# Altium project ESP32 S3_USB Dongle_V1.0.PrjPcb (part 1 of 3)
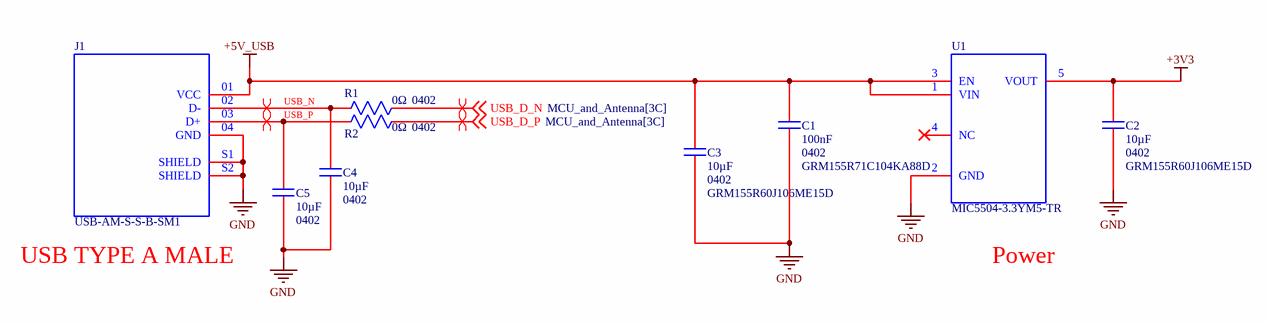
[diagram p0: USB_and_POWER.SchDoc]
5 sheets, 41 parts. Net scope: global (net labels, ports and power ports of the same name join across sheets).
Board file: PCB_V1.0.PcbDoc
Sheets:
  USB_and_POWER.SchDoc
  MCU_and_Antenna.SchDoc
  Display.SchDoc
  EEPROM.SchDoc
  SD_Card.SchDoc

## Sheet USB_and_POWER.SchDoc
size A4; Organization: My Company; Address1: Address Line 1; Address2: Address Line 2; Address3: Address Line 3; Address4: Address Line 4; SheetNumber: 3; SheetTotal: 6

### Parts
C1  GRM155R71C104KA88D  value 100nF  Case/Package: 0402  [CAPC1005X55N]
C2  GRM155R60J106ME15D  value 10µF  Case/Package: 0402  [CAPC1005X55N]
C3  GRM155R60J106ME15D  value 10µF  Case/Package: 0402  [CAPC1005X55N]
C4  value 10µF  Case/Package: 0402  [CAPC1005X55N]  (hidden comment: GRM155R60J106ME15D)
C5  value 10µF  Case/Package: 0402  [CAPC1005X55N]  (hidden comment: GRM155R60J106ME15D)
J1  USB-AM-S-S-B-SM1  [SAMTEC_USB-AM-S-X-X-SM1]
R1  value 0Ω  Case/Package: 0402  [RC0402N_YAG-M]  (hidden comment: RC0402JR-070RL)
R2  value 0Ω  Case/Package: 0402  [RC0402N_YAG-M]  (hidden comment: RC0402JR-070RL)
U1  MIC5504-3.3YM5-TR  [SOT-23-5_MC_MCH]

### Nets
+3V3: C2.2 U1.5(VOUT)
+5V_USB: C1.2 C3.2 J1.01(VCC) U1.1(VIN) U1.3(EN)
GND: C1.1 C2.1 C3.1 C4.1 C5.1 J1.04(GND) J1.S1(SHIELD) J1.S2(SHIELD) U1.2(GND)
USB_D_N: R1.2 ; off-sheet USB_D_N
USB_D_P: R2.2 ; off-sheet USB_D_P
USB_N: C4.2 J1.02(D-) R1.1
USB_P: C5.2 J1.03(D+) R2.1

Not connected (* = marked no-connect by the designer): U1 4(NC)*

### Layout directives
differential pair; differential pair class Diff 90: USB_D_N, USB_D_P, USB_N, USB_P

### Notes on the sheet
- USB TYPE A MALE
- Power
- Author:
- Title:
- Size:
- A4
- Project:
- Approved:
- Revision:
- Modified Date:
- CONFIDENTIAL
- Date:
- SW Version:

### Library data of the parts
C1 = GRM155R71C104KA88D: 16V 100nF X7R ±10% 0402 Multilayer Ceramic Capacitors MLCC - SMD/SMT ROHS; Manufacturer: Murata; Manufacturer Lifecycle Status: NRND; Insulation Resistance: 10GΩ; Supplier: DigiKey; Supplier Part Number: 490-3261-1-ND; Manufacturer Part Number: GRM155R71C104KA88D; RoHS: Compliant; Category: Ceramic Capacitors; Stock: 10363582; Pricing: 1=0,1, 10=0,024, 50=0,0156, 100=0,0132, 500=0,00926, 1000=0,00805, 2500=0,00678, 5000=0,00602 (USD); Case Code (Imperial): 0402; Case Code (Metric): 1005; Country of Origin: Japan, Mainland China, Philippines, Singapore, Thailand; Depth: 500µm; Dielectric: X7R; Dielectric Material: Ceramic; Export Control Classification Number (ECCN) Code: EAR99; Height: 500µm; Harmonized Tariff Schedule (HTS) Code: 8532.24.00.20; Introduction Date: 2004-11-19; Lead Free: Lead Free; Length: 1mm; Lifecycle Status: NRND; Material: Ceramic; Max Operating Temperature: 125°C; Min Operating Temperature: -55°C; Mounting Technology: Surface Mount; Pins: 2; Number of Terminals: 2; Packaging: Cut Tape; Radiation Hardening: No; REACH SVHC: Yes; Schedule B: 8532240020, 8532240020|8532240020|8532240020|8532240020|8532240020|8532240020|8532240020|8532240020|8532240020|8532240020|8532240020|8532240020|8532240020, 8532240020|8532240020|8532240020|8532240020|8532240020|8532240020|8532240020|8532240020|8532240020|8532240020|8532240020|8532240020|8532240020|8532240020, 8532240020|8532240020|8532240020|8532240020|8532240020|8532240020|8532240020|8532240020|8532240020|8532240020|8532240020|8532240020|8532240020|8532240020|8532240020; Termination: SMD/SMT; Thickness: 500µm; Tolerance: 10%; Voltage: 16V; Voltage Rating: 16V; Voltage Rating (DC): 16V; Width: 500µm; ComponentLink1URL: https://datasheet.octopart.com:443/GRM155R71C104KA88D-Murata-datasheet-6387203.pdf?src-supplier=Upverter; ComponentLink1Description: https://datasheet.octopart.com:443/GRM155R71C104KA88D-Murata-datasheet-6387203.pdf?src-supplier=Upverter; ComponentLink2URL: https://datasheet.octopart.com:443/GRM155R71C104KA88D-Murata-datasheet-501912.pdf?src-supplier=Farnell; ComponentLink2Description: https://datasheet.octopart.com:443/GRM155R71C104KA88D-Murata-datasheet-501912.pdf?src-supplier=Farnell; ComponentLink3URL: https://datasheet.octopart.com:443/GRM155R71C104KA88D-Murata-datasheet-62320226.pdf?src-supplier=Farnell; ComponentLink3Description: https://datasheet.octopart.com:443/GRM155R71C104KA88D-Murata-datasheet-62320226.pdf?src-supplier=Farnell; ComponentLink4URL: https://datasheet.octopart.com:443/GRM155R71C104KA88D-Murata-datasheet-514334.pdf?src-supplier=Farnell; ComponentLink4Description: https://datasheet.octopart.com:443/GRM155R71C104KA88D-Murata-datasheet-514334.pdf?src-supplier=Farnell; ComponentLink5URL: https://datasheet.octopart.com:443/GRM155R71C104KA88D-Murata-datasheet-165579666.pdf?src-supplier=TME; ComponentLink5Description: https://datasheet.octopart.com:443/GRM155R71C104KA88D-Murata-datasheet-165579666.pdf?src-supplier=TME; ComponentLink6URL: https://datasheet.octopart.com:443/GRM155R71C104KA88D-Murata-datasheet-81455578.pdf?src-supplier=TME; ComponentLink6Description: https://datasheet.octopart.com:443/GRM155R71C104KA88D-Murata-datasheet-81455578.pdf?src-supplier=TME; ComponentLink7URL: https://datasheet.octopart.com:443/GRM155R71C104KA88D-Murata-datasheet-59876780.pdf?src-supplier=TME; ComponentLink7Description: https://datasheet.octopart.com:443/GRM155R71C104KA88D-Murata-datasheet-59876780.pdf?src-supplier=TME; ComponentLink8URL: https://datasheet.octopart.com:443/GRM155R71C104KA88D-Murata-datasheet-141266224.pdf?src-supplier=Ciiva; ComponentLink8Description: https://datasheet.octopart.com:443/GRM155R71C104KA88D-Murata-datasheet-141266224.pdf?src-supplier=Ciiva; ComponentLink9URL: https://datasheet.octopart.com:443/GRM155R71C104KA88D-Murata-datasheet-140690972.pdf?src-supplier=Ciiva; ComponentLink9Description: https://datasheet.octopart.com:443/GRM155R71C104KA88D-Murata-datasheet-140690972.pdf?src-supplier=Ciiva; ComponentLink10URL: https://datasheet.octopart.com:443/GRM155R71C104KA88D-Murata-datasheet-138740890.pdf?src-supplier=Ciiva; ComponentLink10Description: https://datasheet.octopart.com:443/GRM155R71C104KA88D-Murata-datasheet-138740890.pdf?src-supplier=Ciiva; ComponentLink11URL: https://datasheet.octopart.com:443/GRM155R71C104KA88D-Murata-datasheet-120101189.pdf?src-supplier=Megastar; ComponentLink11Description: https://datasheet.octopart.com:443/GRM155R71C104KA88D-Murata-datasheet-120101189.pdf?src-supplier=Megastar; ComponentLink12URL: https://datasheet.octopart.com:443/GRM155R71C104KA88D-Murata-datasheet-96971104.pdf?src-supplier=Future+Electronics; ComponentLink12Description: https://datasheet.octopart.com:443/GRM155R71C104KA88D-Murata-datasheet-96971104.pdf?src-supplier=Future+Electronics; ComponentLink13URL: https://datasheet.octopart.com:443/GRM155R71C104KA88D-Murata-datasheet-22122223.pdf?src-supplier=Future+Electronics; ComponentLink13Description: https://datasheet.octopart.com:443/GRM155R71C104KA88D-Murata-datasheet-22122223.pdf?src-supplier=Future+Electronics; ComponentLink14URL: https://datasheet.octopart.com:443/GRM155R71C104KA88D-Murata-datasheet-14400564.pdf?src-supplier=Future+Electronics; ComponentLink14Description: https://datasheet.octopart.com:443/GRM155R71C104KA88D-Murata-datasheet-14400564.pdf?src-supplier=Future+Electronics; ComponentLink15URL: https://datasheet.octopart.com:443/GRM155R71C104KA88D-Murata-datasheet-44106293.pdf?src-supplier=Future+Electronics; ComponentLink15Description: https://datasheet.octopart.com:443/GRM155R71C104KA88D-Murata-datasheet-44106293.pdf?src-supplier=Future+Electronics; ComponentLink16URL: https://datasheet.octopart.com/GRM155R71C104KA88D-Murata-datasheet-12515295.pdf; ComponentLink16Description: https://datasheet.octopart.com/GRM155R71C104KA88D-Murata-datasheet-12515295.pdf; ComponentLink17URL: https://datasheet.octopart.com/GRM155R71C104KA88D-Murata-datasheet-12510076.pdf; ComponentLink17Description: https://datasheet.octopart.com/GRM155R71C104KA88D-Murata-datasheet-12510076.pdf; ComponentLink18URL: https://datasheet.octopart.com/GRM155R71C104KA88D-Murata-datasheet-11978611.pdf; ComponentLink18Description: https://datasheet.octopart.com/GRM155R71C104KA88D-Murata-datasheet-11978611.pdf; ComponentLink19URL: https://datasheet.octopart.com/GRM155R71C104KA88D-Murata-datasheet-10025737.pdf; ComponentLink19Description: https://datasheet.octopart.com/GRM155R71C104KA88D-Murata-datasheet-10025737.pdf; ComponentLink20URL: https://datasheet.octopart.com/GRM155R71C104KA88D-Murata-datasheet-8819587.pdf; ComponentLink20Description: https://datasheet.octopart.com/GRM155R71C104KA88D-Murata-datasheet-8819587.pdf; ComponentLink21URL: https://datasheet.octopart.com/GRM155R71C104KA88D-Murata-datasheet-12555248.pdf; ComponentLink21Description: https://datasheet.octopart.com/GRM155R71C104KA88D-Murata-datasheet-12555248.pdf; ComponentLink22URL: https://datasheet.octopart.com:443/GRM155R71C104KA88D-Murata-datasheet-11864723.pdf?src-supplier=Arrow+Electronics; ComponentLink22Description: https://datasheet.octopart.com:443/GRM155R71C104KA88D-Murata-datasheet-11864723.pdf?src-supplier=Arrow+Electronics; ComponentLink23URL: https://datasheet.octopart.com:443/GRM155R71C104KA88D-Murata-datasheet-148211.pdf?src-supplier=Garrett; ComponentLink23Description: https://datasheet.octopart.com:443/GRM155R71C104KA88D-Murata-datasheet-148211.pdf?src-supplier=Garrett; ComponentLink24URL: https://datasheet.octopart.com:443/GRM155R71C104KA88D-Murata-datasheet-118811.pdf?src-supplier=DigiKey; ComponentLink24Description: https://datasheet.octopart.com:443/GRM155R71C104KA88D-Murata-datasheet-118811.pdf?src-supplier=DigiKey; ComponentLink25URL: https://datasheet.octopart.com:443/GRM155R71C104KA88D-Murata-datasheet-38265814.pdf?src-supplier=Newark; ComponentLink25Description: https://datasheet.octopart.com:443/GRM155R71C104KA88D-Murata-datasheet-38265814.pdf?src-supplier=Newark; ComponentLink26URL: http://sigma.octopart.com:80/reach_statement/Murata-company-16.pdf?src-supplier=Compliance+Statements; ComponentLink26Description: http://sigma.octopart.com:80/reach_statement/Murata-company-16.pdf?src-supplier=Compliance+Statements; LCSC Part: C71629
C2-C5 = GRM155R60J106ME15D: 6.3V 10uF X5R ±20% 0402 Multilayer Ceramic Capacitors MLCC - SMD/SMT ROHS; Manufacturer: Murata; Manufacturer Lifecycle Status: IN PRODUCTION; Supplier: DigiKey; Supplier Part Number: 490-13238-6-ND; Manufacturer Part Number: GRM155R60J106ME15D; RoHS: Compliant; Category: Ceramic Capacitors; Stock: 101484; Pricing: 1=0,16, 10=0,088, 50=0,0618, 100=0,0538, 500=0,04036, 1000=0,03624, 2500=0,0319, 5000=0,02929 (USD); Case Code (Imperial): 0402; Case Code (Metric): 1005; Dielectric: X5R; Dielectric Material: Ceramic; Height: 500µm; Length: 1mm; Lifecycle Status: Production; Material: Ceramic; Max Operating Temperature: 85°C; Min Operating Temperature: -55°C; Mounting Technology: Surface Mount; Number of Terminals: 2; REACH SVHC: Yes; Schedule B: 8532240020, 8532240020|8532240020, 8532240020|8532240020|8532240020, 8532240020|8532240020|8532240020|8532240020; Thickness: 500µm; Tolerance: 20%; Voltage Rating: 6.3V; Voltage Rating (DC): 6.3V; Width: 500µm; ComponentLink1URL: https://datasheet.octopart.com:443/GRM155R60J106ME15D-Murata-datasheet-149522992.pdf?src-supplier=Newark; ComponentLink1Description: https://datasheet.octopart.com:443/GRM155R60J106ME15D-Murata-datasheet-149522992.pdf?src-supplier=Newark; ComponentLink2URL: https://datasheet.octopart.com:443/GRM155R60J106ME15D-Murata-datasheet-165579666.pdf?src-supplier=TME; ComponentLink2Description: https://datasheet.octopart.com:443/GRM155R60J106ME15D-Murata-datasheet-165579666.pdf?src-supplier=TME; ComponentLink3URL: https://datasheet.octopart.com:443/GRM155R60J106ME15D-Murata-datasheet-141266224.pdf?src-supplier=Ciiva; ComponentLink3Description: https://datasheet.octopart.com:443/GRM155R60J106ME15D-Murata-datasheet-141266224.pdf?src-supplier=Ciiva; ComponentLink4URL: https://datasheet.octopart.com:443/GRM155R60J106ME15D-Murata-datasheet-140689297.pdf?src-supplier=Ciiva; ComponentLink4Description: https://datasheet.octopart.com:443/GRM155R60J106ME15D-Murata-datasheet-140689297.pdf?src-supplier=Ciiva; ComponentLink5URL: https://datasheet.octopart.com:443/GRM155R60J106ME15D-Murata-datasheet-138740639.pdf?src-supplier=Ciiva; ComponentLink5Description: https://datasheet.octopart.com:443/GRM155R60J106ME15D-Murata-datasheet-138740639.pdf?src-supplier=Ciiva; ComponentLink6URL: https://datasheet.octopart.com:443/GRM155R60J106ME15D-Murata-datasheet-102370999.pdf?src-supplier=HQonline; ComponentLink6Description: https://datasheet.octopart.com:443/GRM155R60J106ME15D-Murata-datasheet-102370999.pdf?src-supplier=HQonline; ComponentLink7URL: https://datasheet.octopart.com/GRM155R60J106ME15D-Murata-datasheet-12515295.pdf; ComponentLink7Description: https://datasheet.octopart.com/GRM155R60J106ME15D-Murata-datasheet-12515295.pdf; ComponentLink8URL: https://datasheet.octopart.com/GRM155R60J106ME15D-Murata-datasheet-12510076.pdf; ComponentLink8Description: https://datasheet.octopart.com/GRM155R60J106ME15D-Murata-datasheet-12510076.pdf; ComponentLink9URL: https://datasheet.octopart.com/GRM155R60J106ME15D-Murata-datasheet-11978611.pdf; ComponentLink9Description: https://datasheet.octopart.com/GRM155R60J106ME15D-Murata-datasheet-11978611.pdf; ComponentLink10URL: https://datasheet.octopart.com/GRM155R60J106ME15D-Murata-datasheet-10025737.pdf; ComponentLink10Description: https://datasheet.octopart.com/GRM155R60J106ME15D-Murata-datasheet-10025737.pdf; ComponentLink11URL: https://datasheet.octopart.com/GRM155R60J106ME15D-Murata-datasheet-8819587.pdf; ComponentLink11Description: https://datasheet.octopart.com/GRM155R60J106ME15D-Murata-datasheet-8819587.pdf; ComponentLink12URL: http://sigma.octopart.com:80/reach_statement/Murata-company-16.pdf?src-supplier=Compliance+Statements; ComponentLink12Description: http://sigma.octopart.com:80/reach_statement/Murata-company-16.pdf?src-supplier=Compliance+Statements; LCSC Part: C412251
J1 = USB-AM-S-S-B-SM1: USB Connector, USB Type A, USB 2.0, Plug, 4 Positions, Surface Mount, Right Angle; Manufacturer: Samtec; Manufacturer Lifecycle Status: PRODUCTION; Gender: Male; Max Voltage Rating (AC): 30V; Number of Contacts: 4; Number of Ports: 1; Supplier: DigiKey; Supplier Part Number: SAM13046-ND; Manufacturer Part Number: USB-AM-S-S-B-SM1; RoHS: Compliant; Category: Coaxial / RF Cable Assemblies; Stock: 10; Pricing: 1=3,56, 50=2,901, 100=2,462, 500=2,345 (USD); Contact Material: Bronze; Contact Plating: Gold; Depth: 20.7mm; Housing Material: Thermoplastic; Length: 12.5mm; Lifecycle Status: Production; Max Operating Temperature: 85°C; Min Operating Temperature: -50°C; Mounting Technology: Surface Mount; Number of Terminals: 4; Orientation: Right Angle; Packaging: Bulk; Radiation Hardening: No; Termination: Solder; ComponentLink1URL: https://datasheet.octopart.com:443/USB-AM-S-S-B-SM1-Samtec-datasheet-97369336.pdf?src-supplier=Sager+Electronics; ComponentLink1Description: https://datasheet.octopart.com:443/USB-AM-S-S-B-SM1-Samtec-datasheet-97369336.pdf?src-supplier=Sager+Electronics; ComponentLink2URL: https://datasheet.octopart.com:443/USB-AM-S-S-B-SM1-Samtec-datasheet-154665717.pdf?src-supplier=Sager+Electronics; ComponentLink2Description: https://datasheet.octopart.com:443/USB-AM-S-S-B-SM1-Samtec-datasheet-154665717.pdf?src-supplier=Sager+Electronics; ComponentLink3URL: https://sigma.octopart.com:443/97369342/technical_drawing/Samtec-USB-AM-S-S-B-SM1.pdf?src-supplier=Samtec; ComponentLink3Description: https://sigma.octopart.com:443/97369342/technical_drawing/Samtec-USB-AM-S-S-B-SM1.pdf?src-supplier=Samtec; ComponentLink4URL: https://datasheet.octopart.com:443/USB-AM-S-S-B-SM1-Samtec-datasheet-150883678.pdf?src-supplier=Electro+Sonic; ComponentLink4Description: https://datasheet.octopart.com:443/USB-AM-S-S-B-SM1-Samtec-datasheet-150883678.pdf?src-supplier=Electro+Sonic; ComponentLink5URL: https://datasheet.octopart.com:443/USB-AM-S-S-B-SM1-Samtec-datasheet-130009934.pdf?src-supplier=Electro+Sonic; ComponentLink5Description: https://datasheet.octopart.com:443/USB-AM-S-S-B-SM1-Samtec-datasheet-130009934.pdf?src-supplier=Electro+Sonic; ComponentLink6URL: https://datasheet.octopart.com:443/USB-AM-S-S-B-SM1-Samtec-datasheet-21561734.pdf?src-supplier=Farnell; ComponentLink6Description: https://datasheet.octopart.com:443/USB-AM-S-S-B-SM1-Samtec-datasheet-21561734.pdf?src-supplier=Farnell; ComponentLink7URL: https://datasheet.octopart.com:443/USB-AM-S-S-B-SM1-Samtec-datasheet-180264035.pdf?src-supplier=JRH+Electronics; ComponentLink7Description: https://datasheet.octopart.com:443/USB-AM-S-S-B-SM1-Samtec-datasheet-180264035.pdf?src-supplier=JRH+Electronics; ComponentLink8URL: https://datasheet.octopart.com:443/USB-AM-S-S-B-SM1-Samtec-datasheet-120095689.pdf?src-supplier=Toby+Electronics; ComponentLink8Description: https://datasheet.octopart.com:443/USB-AM-S-S-B-SM1-Samtec-datasheet-120095689.pdf?src-supplier=Toby+Electronics; ComponentLink9URL: https://datasheet.octopart.com:443/USB-AM-S-S-B-SM1-Samtec-datasheet-116536465.pdf?src-supplier=Toby+Electronics; ComponentLink9Description: https://datasheet.octopart.com:443/USB-AM-S-S-B-SM1-Samtec-datasheet-116536465.pdf?src-supplier=Toby+Electronics; ComponentLink10URL: https://datasheet.octopart.com:443/USB-AM-S-S-B-SM1-Samtec-datasheet-13694303.pdf?src-supplier=_legacy+Avnet; ComponentLink10Description: https://datasheet.octopart.com:443/USB-AM-S-S-B-SM1-Samtec-datasheet-13694303.pdf?src-supplier=_legacy+Avnet; LCSC Part: C7374540
R1 R2 = RC0402JR-070RL: GENERAL PURPOSE CHIP RESISTOR Metal Glaze/thick Film, 0.0625W, 0ohm, Surface Mount, 0402; Manufacturer: Yageo Group; Max Power Dissipation: 63mW; Power Rating: 62.5mW; Temperature Coefficient: 200ppm/°C; Tolerance: 5%; Voltage Rating: 50V; Supplier: DigiKey; Supplier Part Number: 311-0.0JRDKR-ND; Manufacturer Part Number: RC0402JR-070RL; RoHS: Compliant; Category: Chip SMD Resistors; Stock: 12719023; Pricing: 1=0,1, 10=0,010, 25=0,0064, 50=0,0056, 100=0,0048, 250=0,00404, 500=0,00356, 1000=0,00313, 5000=0,00237 (USD); Case Code (Imperial): 0402; China RoHS: Non-Compliant; Composition: Thick Film; Contact Plating: Tin; Depth: 500µm; Features: Moisture Resistant; Height: 350µm; Lead Free: Lead Free; Length: 1mm; Lifecycle Status: Production; Max Operating Temperature: 155°C; Military Standard: Not; Min Operating Temperature: -55°C; Mounting Technology: Surface Mount; Pins: 2; Number of Terminals: 2; Number of Terminations: 2; Packaging: Tape & Reel; Radiation Hardening: No; REACH SVHC: Yes; Schedule B: 8533290000, 8533290000|8533290000, 8533290000|8533290000|8533290000, 8533290000|8533290000|8533290000|8533290000; Termination: SMD/SMT; Voltage Rating (DC): 50V; Width: 500µm; ComponentLink1URL: https://datasheet.octopart.com:443/RC0402JR-070RL-Yageo-datasheet-182189538.pdf?src-supplier=IHS; ComponentLink1Description: https://datasheet.octopart.com:443/RC0402JR-070RL-Yageo-datasheet-182189538.pdf?src-supplier=IHS; ComponentLink2URL: https://datasheet.octopart.com:443/RC0402JR-070RL-Yageo-datasheet-10408619.pdf?src-supplier=Newark; ComponentLink2Description: https://datasheet.octopart.com:443/RC0402JR-070RL-Yageo-datasheet-10408619.pdf?src-supplier=Newark; ComponentLink3URL: https://datasheet.octopart.com:443/RC0402JR-070RL-Yageo-Group-datasheet-181964826.pdf?src-supplier=Newark; ComponentLink3Description: https://datasheet.octopart.com:443/RC0402JR-070RL-Yageo-Group-datasheet-181964826.pdf?src-supplier=Newark; ComponentLink4URL: https://datasheet.octopart.com:443/RC0402JR-070RL-Yageo-Group-datasheet-190305687.pdf?src-supplier=Future+Electronics; ComponentLink4Description: https://datasheet.octopart.com:443/RC0402JR-070RL-Yageo-Group-datasheet-190305687.pdf?src-supplier=Future+Electronics; ComponentLink5URL: https://datasheet.octopart.com:443/RC0402JR-070RL-Yageo-datasheet-164759695.pdf?src-supplier=Future+Electronics; ComponentLink5Description: https://datasheet.octopart.com:443/RC0402JR-070RL-Yageo-datasheet-164759695.pdf?src-supplier=Future+Electronics; ComponentLink6URL: https://datasheet.octopart.com:443/RC0402JR-070RL-Yageo-datasheet-137700087.pdf?src-supplier=Future+Electronics; ComponentLink6Description: https://datasheet.octopart.com:443/RC0402JR-070RL-Yageo-datasheet-137700087.pdf?src-supplier=Future+Electronics; ComponentLink7URL: https://datasheet.octopart.com:443/RC0402JR-070RL-Yageo-datasheet-12531192.pdf?src-supplier=Seeed+Studio; ComponentLink7Description: https://datasheet.octopart.com:443/RC0402JR-070RL-Yageo-datasheet-12531192.pdf?src-supplier=Seeed+Studio; ComponentLink8URL: https://datasheet.octopart.com:443/RC0402JR-070RL-Yageo-datasheet-8324527.pdf?src-supplier=TME; ComponentLink8Description: https://datasheet.octopart.com:443/RC0402JR-070RL-Yageo-datasheet-8324527.pdf?src-supplier=TME; ComponentLink9URL: https://datasheet.octopart.com:443/RC0402JR-070RL-Yageo-datasheet-62067350.pdf?src-supplier=Farnell; ComponentLink9Description: https://datasheet.octopart.com:443/RC0402JR-070RL-Yageo-datasheet-62067350.pdf?src-supplier=Farnell; ComponentLink10URL: https://datasheet.octopart.com:443/RC0402JR-070RL-Yageo-datasheet-8329306.pdf?src-supplier=element14; ComponentLink10Description: https://datasheet.octopart.com:443/RC0402JR-070RL-Yageo-datasheet-8329306.pdf?src-supplier=element14; ComponentLink11URL: https://datasheet.octopart.com:443/RC0402JR-070RL-Yageo-datasheet-505231.pdf?src-supplier=element14; ComponentLink11Description: https://datasheet.octopart.com:443/RC0402JR-070RL-Yageo-datasheet-505231.pdf?src-supplier=element14; ComponentLink12URL: https://datasheet.octopart.com:443/RC0402JR-070RL-Yageo-datasheet-175423674.pdf?src-supplier=SOS+electronic; ComponentLink12Description: https://datasheet.octopart.com:443/RC0402JR-070RL-Yageo-datasheet-175423674.pdf?src-supplier=SOS+electronic; ComponentLink13URL: https://datasheet.octopart.com/RC0402JR-070RL-Yageo-datasheet-73766026.pdf; ComponentLink13Description: https://datasheet.octopart.com/RC0402JR-070RL-Yageo-datasheet-73766026.pdf; ComponentLink14URL: http://sigma.octopart.com:80/conflict_mineral_statement/Yageo-company-3.pdf?src-supplier=Compliance+Statements; ComponentLink14Description: http://sigma.octopart.com:80/conflict_mineral_statement/Yageo-company-3.pdf?src-supplier=Compliance+Statements; ComponentLink15URL: http://sigma.octopart.com:80/rohs_statement/Yageo-company-2.pdf?src-supplier=Compliance+Statements; ComponentLink15Description: http://sigma.octopart.com:80/rohs_statement/Yageo-company-2.pdf?src-supplier=Compliance+Statements; LCSC Part: C60485
U1 = MIC5504-3.3YM5-TR: MIC5504 Series 3.3 V 300 mA Surface Mount Fixed Single Output LDO - SOT-23-5; Manufacturer: Microchip; Manufacturer Lifecycle Status: REL; Accuracy: 2%; Dropout Voltage: 160mV; Max Supply Voltage: 5.5V; Max Junction Temperature (Tj): 125°C; Max Output current: 300mA; Min Current Limit: 400mA; Min Input Voltage: 2.5V; Nominal Output Voltage: 3.3V; Number of Channels: 1; Operating Supply Current: 42µA; Output Voltage: 3.3mV; Power Supply Rejection Ratio (PSRR): 60dB; Quiescent Current: 38µA; Supplier: DigiKey; Supplier Part Number: 576-4764-6-ND; Manufacturer Part Number: MIC5504-3.3YM5-TR; RoHS: Compliant; Category: LDO Voltage Regulators; Stock: 122252; Pricing: 1=0,16, 25=0,1224 (USD); Projected EOL Date: 2039-05-20; Case/Package: SOT-23; Country of Assembly: Thailand; Country of Fabrication: South Korea; Country of Origin: Thailand; Export Control Classification Number (ECCN) Code: EAR99; Height: 1.45mm; HS Code: 8542.39.0090; Harmonized Tariff Schedule (HTS) Code: 8542.39.0060; Lead Free: Lead Free; Length: 2.9mm; Lifecycle Status: Production; Max Operating Temperature: 125°C; Min Operating Temperature: -40°C; Min Supply Voltage: 2.5V; Mounting Technology: Surface Mount; Number of Outputs: 1; Pins: 5; Number of Regulators: 1; Output Current: 300mA; Output Type: Fixed; Packaging: Cut Tape; REACH SVHC: No; Schedule B: 8542390000, 8542390000|8542390000|8542390000|8542390000|8542390000; Width: 1.6mm; ComponentLink1URL: https://datasheet.octopart.com:443/MIC5504-3.3YM5-TR-Microchip-datasheet-178203070.pdf?src-supplier=Microchip; ComponentLink1Description: https://datasheet.octopart.com:443/MIC5504-3.3YM5-TR-Microchip-datasheet-178203070.pdf?src-supplier=Microchip; ComponentLink2URL: https://datasheet.octopart.com:443/MIC5504-3.3YM5-TR-Microchip-datasheet-137404938.pdf?src-supplier=Microchip; ComponentLink2Description: https://datasheet.octopart.com:443/MIC5504-3.3YM5-TR-Microchip-datasheet-137404938.pdf?src-supplier=Microchip; ComponentLink3URL: https://datasheet.octopart.com:443/MIC5504-3.3YM5-TR-Microchip-datasheet-138897052.pdf?src-supplier=SOS+electronic; ComponentLink3Description: https://datasheet.octopart.com:443/MIC5504-3.3YM5-TR-Microchip-datasheet-138897052.pdf?src-supplier=SOS+electronic; ComponentLink4URL: https://datasheet.octopart.com:443/MIC5504-3.3YM5-TR-Microchip-datasheet-61114938.pdf?src-supplier=element14+APAC; ComponentLink4Description: https://datasheet.octopart.com:443/MIC5504-3.3YM5-TR-Microchip-datasheet-61114938.pdf?src-supplier=element14+APAC; ComponentLink5URL: https://datasheet.octopart.com:443/MIC5504-3.3YM5-TR-Microchip-datasheet-33028821.pdf?src-supplier=Newark; ComponentLink5Description: https://datasheet.octopart.com:443/MIC5504-3.3YM5-TR-Microchip-datasheet-33028821.pdf?src-supplier=Newark; ComponentLink6URL: https://datasheet.octopart.com:443/MIC5504-3.3YM5-TR-Microchip-datasheet-137453438.pdf?src-supplier=Master+Electronics; ComponentLink6Description: https://datasheet.octopart.com:443/MIC5504-3.3YM5-TR-Microchip-datasheet-137453438.pdf?src-supplier=Master+Electronics; ComponentLink7URL: https://datasheet.octopart.com:443/MIC5504-3.3YM5-TR-Microchip-datasheet-142675560.pdf?src-supplier=TME; ComponentLink7Description: https://datasheet.octopart.com:443/MIC5504-3.3YM5-TR-Microchip-datasheet-142675560.pdf?src-supplier=TME; ComponentLink8URL: http://sigma.octopart.com:80/188454461/materials_sheet/Microchip-MIC5504-3.3YM5-TR.pdf?src-supplier=Compliance+Statements; ComponentLink8Description: http://sigma.octopart.com:80/188454461/materials_sheet/Microchip-MIC5504-3.3YM5-TR.pdf?src-supplier=Compliance+Statements; ComponentLink9URL: http://sigma.octopart.com:80/rohs_statement/Microchip-company-71.pdf?src-supplier=Compliance+Statements; ComponentLink9Description: http://sigma.octopart.com:80/rohs_statement/Microchip-company-71.pdf?src-supplier=Compliance+Statements; ComponentLink10URL: http://sigma.octopart.com:80/reach_statement/Microchip-company-70.pdf?src-supplier=Compliance+Statements; ComponentLink10Description: http://sigma.octopart.com:80/reach_statement/Microchip-company-70.pdf?src-supplier=Compliance+Statements; ComponentLink11URL: http://sigma.octopart.com:80/conflict_mineral_statement/Microchip-company-69.pdf?src-supplier=Compliance+Statements; ComponentLink11Description: http://sigma.octopart.com:80/conflict_mineral_statement/Microchip-company-69.pdf?src-supplier=Compliance+Statements; ComponentLink12URL: http://sigma.octopart.com:80/conflict_mineral_statement/Microchip-company-68.pdf?src-supplier=Compliance+Statements; ComponentLink12Description: http://sigma.octopart.com:80/conflict_mineral_statement/Microchip-company-68.pdf?src-supplier=Compliance+Statements; LCSC Part: C88419

## Sheet MCU_and_Antenna.SchDoc
size A4; Organization: My Company; Address1: Address Line 1; Address2: Address Line 2; Address3: Address Line 3; Address4: Address Line 4; SheetNumber: 4; SheetTotal: 6
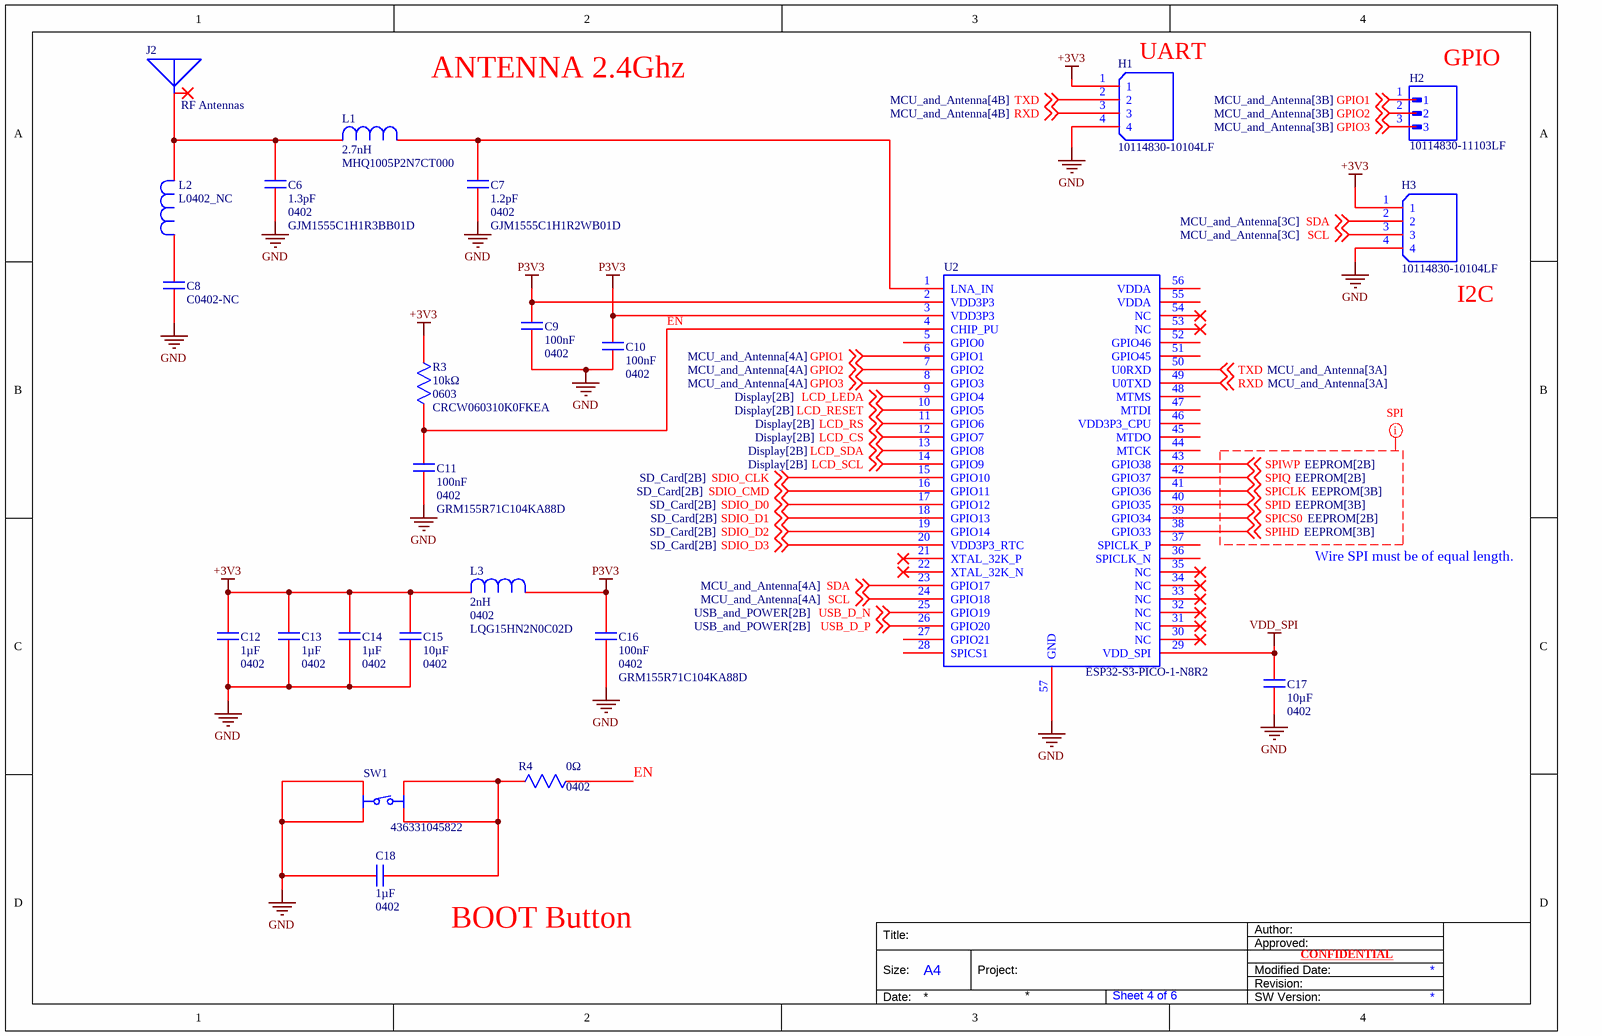
[diagram p1: MCU_and_Antenna.SchDoc]

### Parts
C6  GJM1555C1H1R3BB01D  value 1.3pF  Case Code (Imperial): 0402  [CAPC1005X55N]
C7  GJM1555C1H1R2WB01D  value 1.2pF  Case/Package: 0402  [CAPC1005X55N]
C8  C0402-NC  [CAPC1005X55N - NC]
C9  value 100nF  Case/Package: 0402  [CAPC1005X55N]  (hidden comment: GRM155R71C104KA88D)
C10  value 100nF  Case/Package: 0402  [CAPC1005X55N]  (hidden comment: GRM155R71C104KA88D)
C11  GRM155R71C104KA88D  value 100nF  Case/Package: 0402  [CAPC1005X55N]
C12  value 1µF  Case/Package: 0402  [CAPC1005X55N]  (hidden comment: CL05A105KP5NNNC)
C13  value 1µF  Case/Package: 0402  [CAPC1005X55N]  (hidden comment: CL05A105KP5NNNC)
C14  value 1µF  Case/Package: 0402  [CAPC1005X55N]  (hidden comment: CL05A105KP5NNNC)
C15  value 10µF  Case/Package: 0402  [CAPC1005X55N]  (hidden comment: GRM155R60J106ME15D)
C16  GRM155R71C104KA88D  value 100nF  Case/Package: 0402  [CAPC1005X55N]
C17  value 10µF  Case/Package: 0402  [CAPC1005X55N]  (hidden comment: GRM155R60J106ME15D)
C18  value 1µF  Case/Package: 0402  [CAPC1005X55N]  (hidden comment: CL05A105KP5NNNC)
H1  10114830-10104LF  [AMPHENOL_10114830-10104LF]
H2  10114830-11103LF  [AMPHENOL_10114830-11103LF]
H3  10114830-10104LF  [AMPHENOL_10114830-10104LF]
J2  RF Antennas  [ANT3216LL00R2400A]
L1  MHQ1005P2N7CT000  value 2.7nH  [IND_1005_TDK]
L2  L0402_NC  [IND_1005_TDK_NC]
L3  LQG15HN2N0C02D  value 2nH  Case/Package: 0402  [INDC1005X55N]
R3  CRCW060310K0FKEA  value 10kΩ  Case Code (Imperial): 0603  [RES_CRCW_0603]
R4  value 0Ω  Case/Package: 0402  [RC0402N_YAG-M]  (hidden comment: RC0402JR-070RL)
SW1  436331045822  [436331045822]
U2  ESP32-S3-PICO-1-N8R2  [QFN56_7X7_EXP-L]

### Nets
+3V3: C12.2 C13.2 C14.2 C15.2 H1.1 H3.1 L3.2 R3.1
GND: C6.1 C7.1 C8.1 C9.2 C10.2 C11.2 C12.1 C13.1 C14.1 C15.1 C16.2 C17.1 C18.2 H1.4 H3.4 SW1.1 SW1.3 U2.57(GND)
P3V3: C9.1 C10.1 C16.1 L3.1 U2.2(VDD3P3) U2.3(VDD3P3)
VDD_SPI: C17.2 U2.29(VDD_SPI)
EN: C11.1 R3.2 R4.2 U2.4(CHIP_PU)
GPIO1: H2.1 U2.6(GPIO1) ; off-sheet GPIO1
GPIO2: H2.2 U2.7(GPIO2) ; off-sheet GPIO2
GPIO3: H2.3 U2.8(GPIO3) ; off-sheet GPIO3
LCD_CS: U2.12(GPIO7) ; off-sheet LCD_CS
LCD_LEDA: U2.9(GPIO4) ; off-sheet LCD_LEDA
LCD_RESET: U2.10(GPIO5) ; off-sheet LCD_RESET
LCD_RS: U2.11(GPIO6) ; off-sheet LCD_RS
LCD_SCL: U2.14(GPIO9) ; off-sheet LCD_SCL
LCD_SDA: U2.13(GPIO8) ; off-sheet LCD_SDA
RXD: H1.3 U2.49(U0TXD) ; off-sheet RXD
SCL: H3.3 U2.24(GPIO18) ; off-sheet SCL
SDA: H3.2 U2.23(GPIO17) ; off-sheet SDA
SDIO_CLK: U2.15(GPIO10) ; off-sheet SDIO_CLK
SDIO_CMD: U2.16(GPIO11) ; off-sheet SDIO_CMD
SDIO_D0: U2.17(GPIO12) ; off-sheet SDIO_D0
SDIO_D1: U2.18(GPIO13) ; off-sheet SDIO_D1
SDIO_D2: U2.19(GPIO14) ; off-sheet SDIO_D2
SDIO_D3: U2.20(VDD3P3_RTC) ; off-sheet SDIO_D3
SPICLK: U2.41(GPIO36) ; off-sheet SPICLK
SPICS0: U2.39(GPIO34) ; off-sheet SPICS0
SPID: U2.40(GPIO35) ; off-sheet SPID
SPIHD: U2.38(GPIO33) ; off-sheet SPIHD
SPIQ: U2.42(GPIO37) ; off-sheet SPIQ
SPIWP: U2.43(GPIO38) ; off-sheet SPIWP
TXD: H1.2 U2.50(U0RXD) ; off-sheet TXD
USB_D_N: U2.25(GPIO19) ; off-sheet USB_D_N
USB_D_P: U2.26(GPIO20) ; off-sheet USB_D_P
NetC6_2: C6.2 J2.1 L1.2 L2.1
NetC7_2: C7.2 L1.1 U2.1(LNA_IN)
NetC8_2: C8.2 L2.2
NetC18_1: C18.1 R4.1 SW1.2 SW1.4

Not connected (* = marked no-connect by the designer): J2 2*; U2 5(GPIO0) 21(XTAL_32K_P)* 22(XTAL_32K_N)* 27(GPIO21) 28(SPICS1) 30(NC)* 31(NC)* 32(NC)* 33(NC)* 34(NC)* 35(NC)* 36(SPICLK_N) 37(SPICLK_P) 44(MTCK) 45(MTDO) 46(VDD3P3_CPU) 47(MTDI) 48(MTMS) 51(GPIO45) 52(GPIO46) 53(NC)* 54(NC)* 55(VDDA) 56(VDDA)

### Layout directives
mark named SPI: SPICLK, SPICS0, SPID, SPIHD, SPIQ, SPIWP

### Notes on the sheet
- ANTENNA 2.4Ghz
- (near H1) UART
- (near H2) GPIO
- I2C
- Wire SPI must be of equal length.
- BOOT Button
- Author:
- Title:
- Size:
- A4
- Project:
- Approved:
- Revision:
- Modified Date:
- CONFIDENTIAL
- Date:
- SW Version: